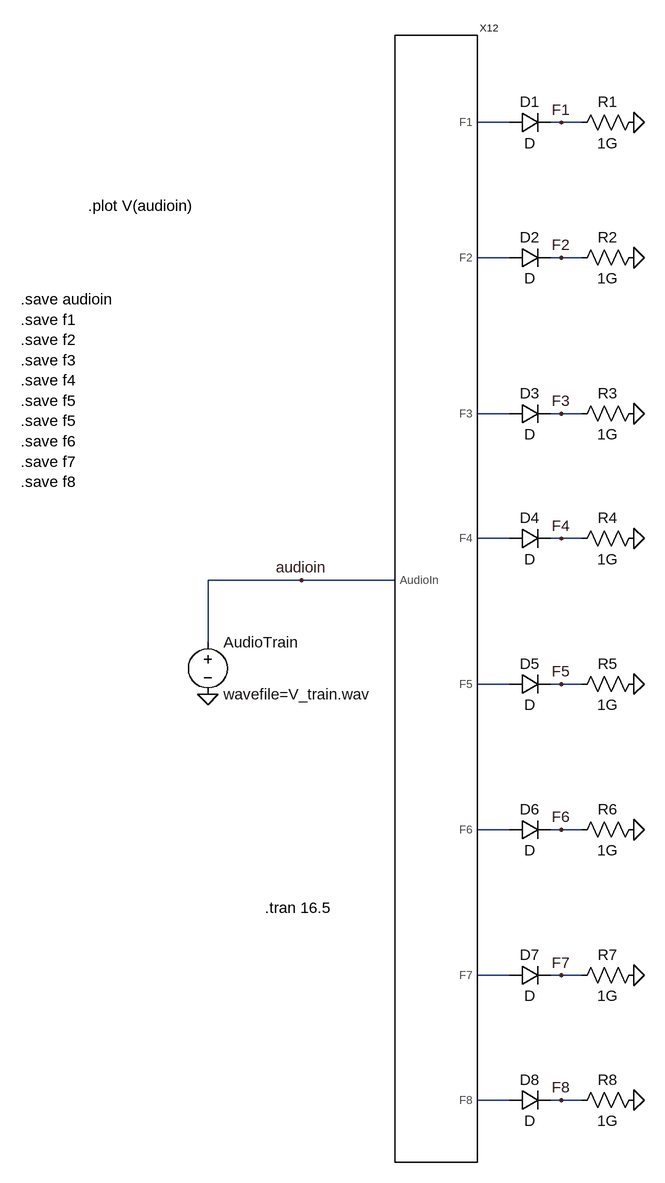
[diagram p0: schematic Filter_Response.asc]
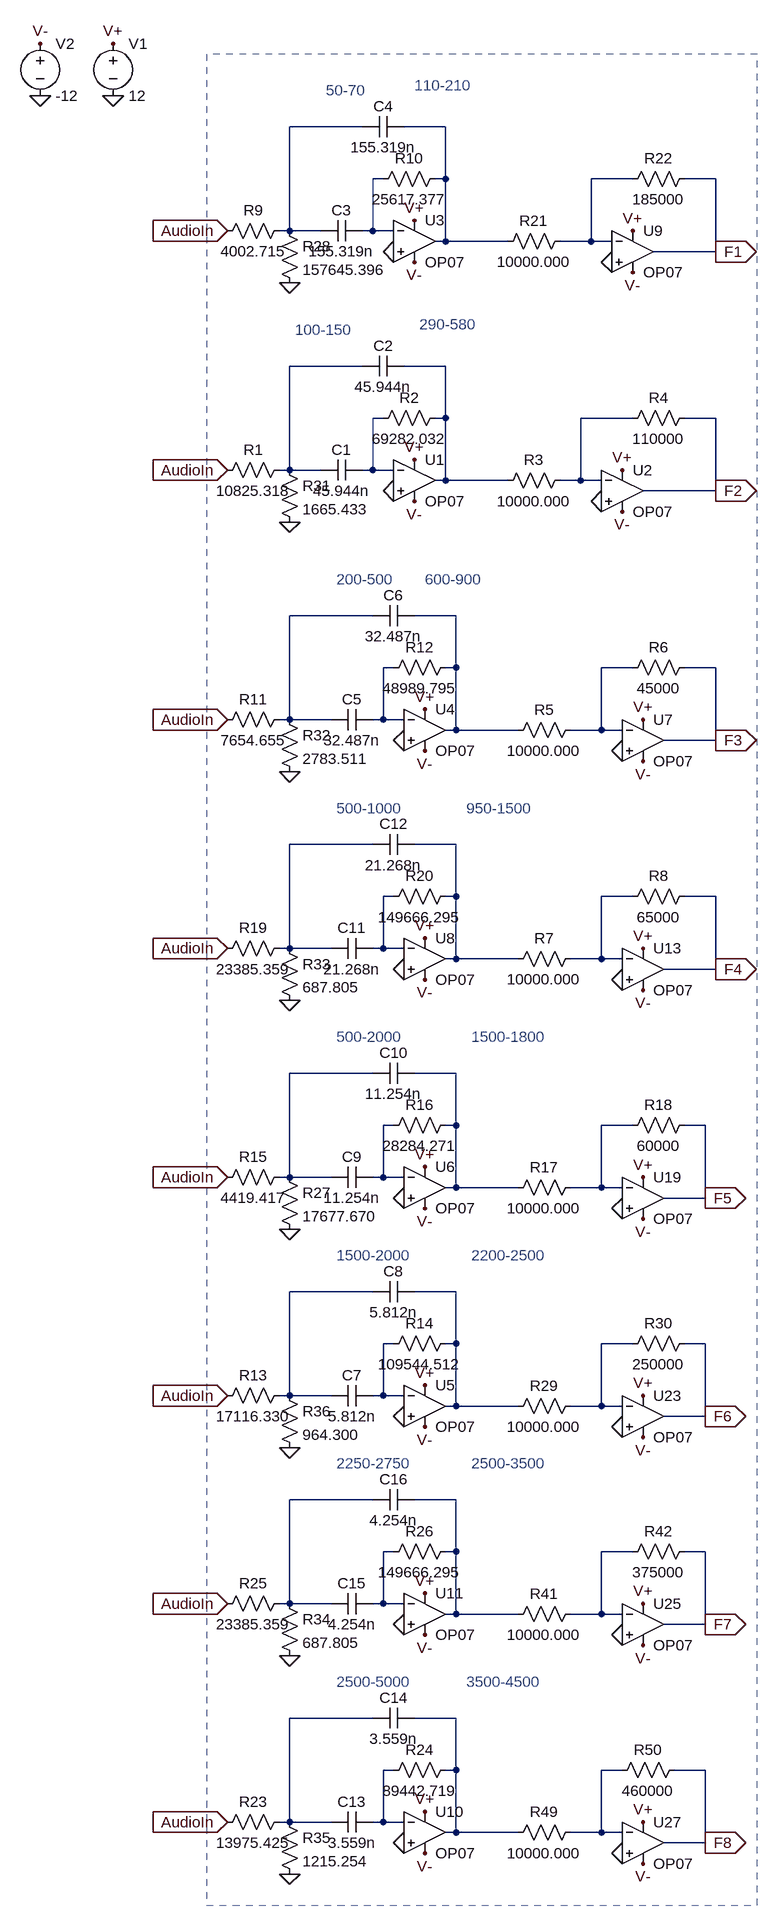
[diagram p1: sub-circuit filterbank.asc]
Filter_Response.asc, the LTspice schematic file:
Version 4
SHEET 1 5076 1812
WIRE 112 -1136 64 -1136
WIRE 192 -1136 176 -1136
WIRE 224 -1136 192 -1136
WIRE 112 -928 64 -928
WIRE 192 -928 176 -928
WIRE 224 -928 192 -928
WIRE 112 -688 64 -688
WIRE 192 -688 176 -688
WIRE 224 -688 192 -688
WIRE 112 -496 64 -496
WIRE 192 -496 176 -496
WIRE 224 -496 192 -496
WIRE -208 -432 -352 -432
WIRE -64 -432 -208 -432
WIRE -352 -336 -352 -432
WIRE 112 -272 64 -272
WIRE 192 -272 176 -272
WIRE 224 -272 192 -272
WIRE 112 -48 64 -48
WIRE 192 -48 176 -48
WIRE 224 -48 192 -48
WIRE 112 176 64 176
WIRE 192 176 176 176
WIRE 224 176 192 176
WIRE 112 368 64 368
WIRE 192 368 176 368
WIRE 224 368 192 368
FLAG -352 -256 0
FLAG -208 -432 audioin
FLAG 304 -1136 0
FLAG 304 -928 0
FLAG 304 -688 0
FLAG 304 -496 0
FLAG 304 -272 0
FLAG 304 -48 0
FLAG 304 176 0
FLAG 304 368 0
FLAG 192 -1136 F1
FLAG 192 -928 F2
FLAG 192 -688 F3
FLAG 192 -496 F4
FLAG 192 -272 F5
FLAG 192 -48 F6
FLAG 192 176 F7
FLAG 192 368 F8
SYMBOL voltage -352 -352 R0
SYMATTR InstName AudioTrain
SYMATTR Value wavefile=V_train.wav
SYMBOL FilterBank -64 464 R0
SYMATTR InstName X12
SYMBOL res 320 -1152 R90
WINDOW 0 0 56 VBottom 2
WINDOW 3 32 56 VTop 2
SYMATTR InstName R1
SYMATTR Value 1G
SYMBOL diode 112 -1120 R270
WINDOW 0 32 32 VTop 2
WINDOW 3 0 32 VBottom 2
SYMATTR InstName D1
SYMBOL res 320 -944 R90
WINDOW 0 0 56 VBottom 2
WINDOW 3 32 56 VTop 2
SYMATTR InstName R2
SYMATTR Value 1G
SYMBOL diode 112 -912 R270
WINDOW 0 32 32 VTop 2
WINDOW 3 0 32 VBottom 2
SYMATTR InstName D2
SYMBOL res 320 -704 R90
WINDOW 0 0 56 VBottom 2
WINDOW 3 32 56 VTop 2
SYMATTR InstName R3
SYMATTR Value 1G
SYMBOL diode 112 -672 R270
WINDOW 0 32 32 VTop 2
WINDOW 3 0 32 VBottom 2
SYMATTR InstName D3
SYMBOL res 320 -512 R90
WINDOW 0 0 56 VBottom 2
WINDOW 3 32 56 VTop 2
SYMATTR InstName R4
SYMATTR Value 1G
SYMBOL diode 112 -480 R270
WINDOW 0 32 32 VTop 2
WINDOW 3 0 32 VBottom 2
SYMATTR InstName D4
SYMBOL res 320 -288 R90
WINDOW 0 0 56 VBottom 2
WINDOW 3 32 56 VTop 2
SYMATTR InstName R5
SYMATTR Value 1G
SYMBOL diode 112 -256 R270
WINDOW 0 32 32 VTop 2
WINDOW 3 0 32 VBottom 2
SYMATTR InstName D5
SYMBOL res 320 -64 R90
WINDOW 0 0 56 VBottom 2
WINDOW 3 32 56 VTop 2
SYMATTR InstName R6
SYMATTR Value 1G
SYMBOL diode 112 -32 R270
WINDOW 0 32 32 VTop 2
WINDOW 3 0 32 VBottom 2
SYMATTR InstName D6
SYMBOL res 320 160 R90
WINDOW 0 0 56 VBottom 2
WINDOW 3 32 56 VTop 2
SYMATTR InstName R7
SYMATTR Value 1G
SYMBOL diode 112 192 R270
WINDOW 0 32 32 VTop 2
WINDOW 3 0 32 VBottom 2
SYMATTR InstName D7
SYMBOL res 320 352 R90
WINDOW 0 0 56 VBottom 2
WINDOW 3 32 56 VTop 2
SYMATTR InstName R8
SYMATTR Value 1G
SYMBOL diode 112 384 R270
WINDOW 0 32 32 VTop 2
WINDOW 3 0 32 VBottom 2
SYMATTR InstName D8
TEXT -264 72 Left 2 !.tran 16.5
TEXT -640 -864 Left 2 !.save audioin\n.save f1\n.save f2\n.save f3\n.save f4\n.save f5\n.save f5\n.save f6\n.save f7\n.save f8
TEXT -536 -1008 Left 2 !.plot V(audioin)

filterbank.asc, the sub-circuit schematic file:
Version 4
SHEET 1 3812 1988
WIRE -704 -2016 -816 -2016
WIRE -576 -2016 -640 -2016
WIRE -672 -1936 -688 -1936
WIRE -576 -1936 -576 -2016
WIRE -576 -1936 -592 -1936
WIRE -288 -1936 -352 -1936
WIRE -160 -1936 -208 -1936
WIRE -816 -1856 -816 -2016
WIRE -816 -1856 -832 -1856
WIRE -768 -1856 -816 -1856
WIRE -688 -1856 -688 -1936
WIRE -688 -1856 -704 -1856
WIRE -656 -1856 -688 -1856
WIRE -576 -1840 -576 -1936
WIRE -576 -1840 -592 -1840
WIRE -480 -1840 -576 -1840
WIRE -352 -1840 -352 -1936
WIRE -352 -1840 -400 -1840
WIRE -320 -1840 -352 -1840
WIRE -160 -1824 -160 -1936
WIRE -160 -1824 -256 -1824
WIRE -704 -1648 -816 -1648
WIRE -576 -1648 -640 -1648
WIRE -672 -1568 -688 -1568
WIRE -576 -1568 -576 -1648
WIRE -576 -1568 -592 -1568
WIRE -288 -1568 -368 -1568
WIRE -160 -1568 -208 -1568
WIRE -816 -1488 -816 -1648
WIRE -816 -1488 -832 -1488
WIRE -768 -1488 -816 -1488
WIRE -688 -1488 -688 -1568
WIRE -688 -1488 -704 -1488
WIRE -656 -1488 -688 -1488
WIRE -576 -1472 -576 -1568
WIRE -576 -1472 -592 -1472
WIRE -480 -1472 -576 -1472
WIRE -368 -1472 -368 -1568
WIRE -368 -1472 -400 -1472
WIRE -336 -1472 -368 -1472
WIRE -160 -1456 -160 -1568
WIRE -160 -1456 -272 -1456
WIRE -688 -1264 -816 -1264
WIRE -560 -1264 -624 -1264
WIRE -656 -1184 -672 -1184
WIRE -560 -1184 -560 -1264
WIRE -560 -1184 -576 -1184
WIRE -288 -1184 -336 -1184
WIRE -160 -1184 -208 -1184
WIRE -816 -1104 -816 -1264
WIRE -816 -1104 -832 -1104
WIRE -752 -1104 -816 -1104
WIRE -672 -1104 -672 -1184
WIRE -672 -1104 -688 -1104
WIRE -640 -1104 -672 -1104
WIRE -560 -1088 -560 -1184
WIRE -560 -1088 -576 -1088
WIRE -464 -1088 -560 -1088
WIRE -336 -1088 -336 -1184
WIRE -336 -1088 -384 -1088
WIRE -304 -1088 -336 -1088
WIRE -160 -1072 -160 -1184
WIRE -160 -1072 -240 -1072
WIRE -688 -912 -816 -912
WIRE -560 -912 -624 -912
WIRE -656 -832 -672 -832
WIRE -560 -832 -560 -912
WIRE -560 -832 -576 -832
WIRE -288 -832 -336 -832
WIRE -160 -832 -208 -832
WIRE -816 -752 -816 -912
WIRE -816 -752 -832 -752
WIRE -752 -752 -816 -752
WIRE -672 -752 -672 -832
WIRE -672 -752 -688 -752
WIRE -640 -752 -672 -752
WIRE -560 -736 -560 -832
WIRE -560 -736 -576 -736
WIRE -464 -736 -560 -736
WIRE -336 -736 -336 -832
WIRE -336 -736 -384 -736
WIRE -304 -736 -336 -736
WIRE -160 -720 -160 -832
WIRE -160 -720 -240 -720
WIRE -688 -560 -816 -560
WIRE -560 -560 -624 -560
WIRE -656 -480 -672 -480
WIRE -560 -480 -560 -560
WIRE -560 -480 -576 -480
WIRE -288 -480 -336 -480
WIRE -176 -480 -208 -480
WIRE -816 -400 -816 -560
WIRE -816 -400 -832 -400
WIRE -752 -400 -816 -400
WIRE -672 -400 -672 -480
WIRE -672 -400 -688 -400
WIRE -640 -400 -672 -400
WIRE -560 -384 -560 -480
WIRE -560 -384 -576 -384
WIRE -464 -384 -560 -384
WIRE -336 -384 -336 -480
WIRE -336 -384 -384 -384
WIRE -304 -384 -336 -384
WIRE -176 -368 -176 -480
WIRE -176 -368 -240 -368
WIRE -688 -224 -816 -224
WIRE -560 -224 -624 -224
WIRE -656 -144 -672 -144
WIRE -560 -144 -560 -224
WIRE -560 -144 -576 -144
WIRE -288 -144 -336 -144
WIRE -176 -144 -208 -144
WIRE -816 -64 -816 -224
WIRE -816 -64 -832 -64
WIRE -752 -64 -816 -64
WIRE -672 -64 -672 -144
WIRE -672 -64 -688 -64
WIRE -640 -64 -672 -64
WIRE -560 -48 -560 -144
WIRE -560 -48 -576 -48
WIRE -464 -48 -560 -48
WIRE -336 -48 -336 -144
WIRE -336 -48 -384 -48
WIRE -304 -48 -336 -48
WIRE -176 -32 -176 -144
WIRE -176 -32 -240 -32
WIRE -688 96 -816 96
WIRE -560 96 -624 96
WIRE -656 176 -672 176
WIRE -560 176 -560 96
WIRE -560 176 -576 176
WIRE -288 176 -336 176
WIRE -176 176 -208 176
WIRE -816 256 -816 96
WIRE -816 256 -832 256
WIRE -752 256 -816 256
WIRE -672 256 -672 176
WIRE -672 256 -688 256
WIRE -640 256 -672 256
WIRE -560 272 -560 176
WIRE -560 272 -576 272
WIRE -464 272 -560 272
WIRE -336 272 -336 176
WIRE -336 272 -384 272
WIRE -304 272 -336 272
WIRE -176 288 -176 176
WIRE -176 288 -240 288
WIRE -688 432 -816 432
WIRE -560 432 -624 432
WIRE -656 512 -672 512
WIRE -560 512 -560 432
WIRE -560 512 -576 512
WIRE -304 512 -336 512
WIRE -176 512 -224 512
WIRE -816 592 -816 432
WIRE -816 592 -832 592
WIRE -752 592 -816 592
WIRE -672 592 -672 512
WIRE -672 592 -688 592
WIRE -640 592 -672 592
WIRE -560 608 -560 512
WIRE -560 608 -576 608
WIRE -464 608 -560 608
WIRE -336 608 -336 512
WIRE -336 608 -384 608
WIRE -304 608 -336 608
WIRE -176 624 -176 512
WIRE -176 624 -240 624
FLAG -288 -1856 V+
FLAG -288 -1792 V-
FLAG -160 -1824 F1
IOPIN -160 -1824 Out
FLAG -176 -368 F5
IOPIN -176 -368 Out
FLAG -176 -32 F6
IOPIN -176 -32 Out
FLAG -160 -1456 F2
IOPIN -160 -1456 Out
FLAG -160 -1072 F3
IOPIN -160 -1072 Out
FLAG -176 624 F8
IOPIN -176 624 Out
FLAG -160 -720 F4
IOPIN -160 -720 Out
FLAG -176 288 F7
IOPIN -176 288 Out
FLAG -320 -1808 0
FLAG -304 -1488 V+
FLAG -304 -1424 V-
FLAG -336 -1440 0
FLAG -272 -1104 V+
FLAG -272 -1040 V-
FLAG -304 -1056 0
FLAG -272 -752 V+
FLAG -272 -688 V-
FLAG -304 -704 0
FLAG -272 -400 V+
FLAG -272 -336 V-
FLAG -304 -352 0
FLAG -272 -64 V+
FLAG -272 0 V-
FLAG -304 -16 0
FLAG -272 256 V+
FLAG -272 320 V-
FLAG -304 304 0
FLAG -272 592 V+
FLAG -272 656 V-
FLAG -304 640 0
FLAG -1200 -2064 0
FLAG -1088 -2064 0
FLAG -1088 -2144 V+
FLAG -1200 -2144 V-
FLAG -624 -1504 V+
FLAG -624 -1440 V-
FLAG -656 -1456 0
FLAG -624 -1872 V+
FLAG -624 -1808 V-
FLAG -656 -1824 0
FLAG -608 -1120 V+
FLAG -608 -1056 V-
FLAG -640 -1072 0
FLAG -608 -80 V+
FLAG -608 -16 V-
FLAG -640 -32 0
FLAG -608 -416 V+
FLAG -608 -352 V-
FLAG -640 -368 0
FLAG -608 -768 V+
FLAG -608 -704 V-
FLAG -640 -720 0
FLAG -608 576 V+
FLAG -608 640 V-
FLAG -640 624 0
FLAG -608 240 V+
FLAG -608 304 V-
FLAG -640 288 0
FLAG -912 -1856 AudioIn
IOPIN -912 -1856 In
FLAG -912 -752 AudioIn
IOPIN -912 -752 In
FLAG -912 -1488 AudioIn
IOPIN -912 -1488 In
FLAG -912 -400 AudioIn
IOPIN -912 -400 In
FLAG -912 -1104 AudioIn
IOPIN -912 -1104 In
FLAG -912 256 AudioIn
IOPIN -912 256 In
FLAG -912 -64 AudioIn
IOPIN -912 -64 In
FLAG -912 592 AudioIn
IOPIN -912 592 In
FLAG -816 -320 0
FLAG -816 -1776 0
FLAG -816 672 0
FLAG -816 -1408 0
FLAG -816 -1024 0
FLAG -816 -672 0
FLAG -816 16 0
FLAG -816 336 0
SYMBOL Opamps\\OP07 -288 -1888 R0
SYMATTR InstName U9
SYMBOL res -384 -1856 R90
WINDOW 0 0 56 VBottom 2
WINDOW 3 32 56 VTop 2
SYMATTR InstName R21
SYMATTR Value 10000.000
SYMBOL res -192 -1952 R90
WINDOW 0 0 56 VBottom 2
WINDOW 3 32 56 VTop 2
SYMATTR InstName R22
SYMATTR Value 185000
SYMBOL Opamps\\OP07 -304 -1520 R0
SYMATTR InstName U2
SYMBOL res -384 -1488 R90
WINDOW 0 0 56 VBottom 2
WINDOW 3 32 56 VTop 2
SYMATTR InstName R3
SYMATTR Value 10000.000
SYMBOL res -192 -1584 R90
WINDOW 0 0 56 VBottom 2
WINDOW 3 32 56 VTop 2
SYMATTR InstName R4
SYMATTR Value 110000
SYMBOL Opamps\\OP07 -272 -1136 R0
SYMATTR InstName U7
SYMBOL res -368 -1104 R90
WINDOW 0 0 56 VBottom 2
WINDOW 3 32 56 VTop 2
SYMATTR InstName R5
SYMATTR Value 10000.000
SYMBOL res -192 -1200 R90
WINDOW 0 0 56 VBottom 2
WINDOW 3 32 56 VTop 2
SYMATTR InstName R6
SYMATTR Value 45000
SYMBOL Opamps\\OP07 -272 -784 R0
SYMATTR InstName U13
SYMBOL res -368 -752 R90
WINDOW 0 0 56 VBottom 2
WINDOW 3 32 56 VTop 2
SYMATTR InstName R7
SYMATTR Value 10000.000
SYMBOL res -192 -848 R90
WINDOW 0 0 56 VBottom 2
WINDOW 3 32 56 VTop 2
SYMATTR InstName R8
SYMATTR Value 65000
SYMBOL Opamps\\OP07 -272 -432 R0
SYMATTR InstName U19
SYMBOL res -368 -400 R90
WINDOW 0 0 56 VBottom 2
WINDOW 3 32 56 VTop 2
SYMATTR InstName R17
SYMATTR Value 10000.000
SYMBOL res -192 -496 R90
WINDOW 0 0 56 VBottom 2
WINDOW 3 32 56 VTop 2
SYMATTR InstName R18
SYMATTR Value 60000
SYMBOL Opamps\\OP07 -272 -96 R0
SYMATTR InstName U23
SYMBOL res -368 -64 R90
WINDOW 0 0 56 VBottom 2
WINDOW 3 32 56 VTop 2
SYMATTR InstName R29
SYMATTR Value 10000.000
SYMBOL res -192 -160 R90
WINDOW 0 0 56 VBottom 2
WINDOW 3 32 56 VTop 2
SYMATTR InstName R30
SYMATTR Value 250000
SYMBOL Opamps\\OP07 -272 224 R0
SYMATTR InstName U25
SYMBOL res -368 256 R90
WINDOW 0 0 56 VBottom 2
WINDOW 3 32 56 VTop 2
SYMATTR InstName R41
SYMATTR Value 10000.000
SYMBOL res -192 160 R90
WINDOW 0 0 56 VBottom 2
WINDOW 3 32 56 VTop 2
SYMATTR InstName R42
SYMATTR Value 375000
SYMBOL Opamps\\OP07 -272 560 R0
SYMATTR InstName U27
SYMBOL res -368 592 R90
WINDOW 0 0 56 VBottom 2
WINDOW 3 32 56 VTop 2
SYMATTR InstName R49
SYMATTR Value 10000.000
SYMBOL res -208 496 R90
WINDOW 0 0 56 VBottom 2
WINDOW 3 32 56 VTop 2
SYMATTR InstName R50
SYMATTR Value 460000
SYMBOL voltage -1088 -2160 R0
WINDOW 123 0 0 Left 2
WINDOW 39 0 0 Left 2
SYMATTR InstName V1
SYMATTR Value 12
SYMBOL voltage -1200 -2160 R0
WINDOW 123 0 0 Left 2
WINDOW 39 0 0 Left 2
SYMATTR InstName V2
SYMATTR Value -12
SYMBOL Opamps\\OP07 -624 -1536 R0
SYMATTR InstName U1
SYMBOL res -816 -1504 R90
WINDOW 0 0 56 VBottom 2
WINDOW 3 32 56 VTop 2
SYMATTR InstName R1
SYMATTR Value 10825.318
SYMBOL cap -704 -1504 R90
WINDOW 0 0 32 VBottom 2
WINDOW 3 32 32 VTop 2
SYMATTR InstName C1
SYMATTR Value 45.944n
SYMBOL cap -640 -1664 R90
WINDOW 0 0 32 VBottom 2
WINDOW 3 32 32 VTop 2
SYMATTR InstName C2
SYMATTR Value 45.944n
SYMBOL res -576 -1584 R90
WINDOW 0 0 56 VBottom 2
WINDOW 3 32 56 VTop 2
SYMATTR InstName R2
SYMATTR Value 69282.032
SYMBOL Opamps\\OP07 -624 -1904 R0
SYMATTR InstName U3
SYMBOL res -816 -1872 R90
WINDOW 0 0 56 VBottom 2
WINDOW 3 32 56 VTop 2
SYMATTR InstName R9
SYMATTR Value 4002.715
SYMBOL cap -704 -1872 R90
WINDOW 0 0 32 VBottom 2
WINDOW 3 32 32 VTop 2
SYMATTR InstName C3
SYMATTR Value 155.319n
SYMBOL cap -640 -2032 R90
WINDOW 0 0 32 VBottom 2
WINDOW 3 32 32 VTop 2
SYMATTR InstName C4
SYMATTR Value 155.319n
SYMBOL res -576 -1952 R90
WINDOW 0 0 56 VBottom 2
WINDOW 3 32 56 VTop 2
SYMATTR InstName R10
SYMATTR Value 25617.377
SYMBOL Opamps\\OP07 -608 -1152 R0
SYMATTR InstName U4
SYMBOL res -816 -1120 R90
WINDOW 0 0 56 VBottom 2
WINDOW 3 32 56 VTop 2
SYMATTR InstName R11
SYMATTR Value 7654.655
SYMBOL cap -688 -1120 R90
WINDOW 0 0 32 VBottom 2
WINDOW 3 32 32 VTop 2
SYMATTR InstName C5
SYMATTR Value 32.487n
SYMBOL cap -624 -1280 R90
WINDOW 0 0 32 VBottom 2
WINDOW 3 32 32 VTop 2
SYMATTR InstName C6
SYMATTR Value 32.487n
SYMBOL res -560 -1200 R90
WINDOW 0 0 56 VBottom 2
WINDOW 3 32 56 VTop 2
SYMATTR InstName R12
SYMATTR Value 48989.795
SYMBOL Opamps\\OP07 -608 -112 R0
SYMATTR InstName U5
SYMBOL res -816 -80 R90
WINDOW 0 0 56 VBottom 2
WINDOW 3 32 56 VTop 2
SYMATTR InstName R13
SYMATTR Value 17116.330
SYMBOL cap -688 -80 R90
WINDOW 0 0 32 VBottom 2
WINDOW 3 32 32 VTop 2
SYMATTR InstName C7
SYMATTR Value 5.812n
SYMBOL cap -624 -240 R90
WINDOW 0 0 32 VBottom 2
WINDOW 3 32 32 VTop 2
SYMATTR InstName C8
SYMATTR Value 5.812n
SYMBOL res -560 -160 R90
WINDOW 0 0 56 VBottom 2
WINDOW 3 32 56 VTop 2
SYMATTR InstName R14
SYMATTR Value 109544.512
SYMBOL Opamps\\OP07 -608 -448 R0
SYMATTR InstName U6
SYMBOL res -816 -416 R90
WINDOW 0 0 56 VBottom 2
WINDOW 3 32 56 VTop 2
SYMATTR InstName R15
SYMATTR Value 4419.417
SYMBOL cap -688 -416 R90
WINDOW 0 0 32 VBottom 2
WINDOW 3 32 32 VTop 2
SYMATTR InstName C9
SYMATTR Value 11.254n
SYMBOL cap -624 -576 R90
WINDOW 0 0 32 VBottom 2
WINDOW 3 32 32 VTop 2
SYMATTR InstName C10
SYMATTR Value 11.254n
SYMBOL res -560 -496 R90
WINDOW 0 0 56 VBottom 2
WINDOW 3 32 56 VTop 2
SYMATTR InstName R16
SYMATTR Value 28284.271
SYMBOL Opamps\\OP07 -608 -800 R0
SYMATTR InstName U8
SYMBOL res -816 -768 R90
WINDOW 0 0 56 VBottom 2
WINDOW 3 32 56 VTop 2
SYMATTR InstName R19
SYMATTR Value 23385.359
SYMBOL cap -688 -768 R90
WINDOW 0 0 32 VBottom 2
WINDOW 3 32 32 VTop 2
SYMATTR InstName C11
SYMATTR Value 21.268n
SYMBOL cap -624 -928 R90
WINDOW 0 0 32 VBottom 2
WINDOW 3 32 32 VTop 2
SYMATTR InstName C12
SYMATTR Value 21.268n
SYMBOL res -560 -848 R90
WINDOW 0 0 56 VBottom 2
WINDOW 3 32 56 VTop 2
SYMATTR InstName R20
SYMATTR Value 149666.295
SYMBOL Opamps\\OP07 -608 544 R0
SYMATTR InstName U10
SYMBOL res -816 576 R90
WINDOW 0 0 56 VBottom 2
WINDOW 3 32 56 VTop 2
SYMATTR InstName R23
SYMATTR Value 13975.425
SYMBOL cap -688 576 R90
WINDOW 0 0 32 VBottom 2
WINDOW 3 32 32 VTop 2
SYMATTR InstName C13
SYMATTR Value 3.559n
SYMBOL cap -624 416 R90
WINDOW 0 0 32 VBottom 2
WINDOW 3 32 32 VTop 2
SYMATTR InstName C14
SYMATTR Value 3.559n
SYMBOL res -560 496 R90
WINDOW 0 0 56 VBottom 2
WINDOW 3 32 56 VTop 2
SYMATTR InstName R24
SYMATTR Value 89442.719
SYMBOL Opamps\\OP07 -608 208 R0
SYMATTR InstName U11
SYMBOL res -816 240 R90
WINDOW 0 0 56 VBottom 2
WINDOW 3 32 56 VTop 2
SYMATTR InstName R25
SYMATTR Value 23385.359
SYMBOL cap -688 240 R90
WINDOW 0 0 32 VBottom 2
WINDOW 3 32 32 VTop 2
SYMATTR InstName C15
SYMATTR Value 4.254n
SYMBOL cap -624 80 R90
WINDOW 0 0 32 VBottom 2
WINDOW 3 32 32 VTop 2
SYMATTR InstName C16
SYMATTR Value 4.254n
SYMBOL res -560 160 R90
WINDOW 0 0 56 VBottom 2
WINDOW 3 32 56 VTop 2
SYMATTR InstName R26
SYMATTR Value 149666.295
SYMBOL res -832 -416 R0
SYMATTR InstName R27
SYMATTR Value 17677.670
SYMBOL res -832 -1872 R0
SYMATTR InstName R28
SYMATTR Value 157645.396
SYMBOL res -832 -1504 R0
SYMATTR InstName R31
SYMATTR Value 1665.433
SYMBOL res -832 -1120 R0
SYMATTR InstName R32
SYMATTR Value 2783.511
SYMBOL res -832 -768 R0
SYMATTR InstName R33
SYMATTR Value 687.805
SYMBOL res -832 240 R0
SYMATTR InstName R34
SYMATTR Value 687.805
SYMBOL res -832 576 R0
SYMATTR InstName R35
SYMATTR Value 1215.254
SYMBOL res -832 -80 R0
SYMATTR InstName R36
SYMATTR Value 964.300
TEXT -544 -968 Left 2 ;950-1500
TEXT -536 -616 Left 2 ;1500-1800
TEXT -536 -280 Left 2 ;2200-2500
TEXT -536 40 Left 2 ;2500-3500
TEXT -544 376 Left 2 ;3500-4500
TEXT -808 -1704 Left 2 ;100-150
TEXT -760 -2072 Left 2 ;50-70
TEXT -744 -1320 Left 2 ;200-500
TEXT -744 -280 Left 2 ;1500-2000
TEXT -744 -616 Left 2 ;500-2000
TEXT -744 -968 Left 2 ;500-1000
TEXT -744 376 Left 2 ;2500-5000
TEXT -744 40 Left 2 ;2250-2750
TEXT -624 -2080 Left 2 ;110-210
TEXT -616 -1712 Left 2 ;290-580
TEXT -608 -1320 Left 2 ;600-900
RECTANGLE Normal -96 -2128 -944 720 1

The netlist it stands for:
* Filter_Response.asc
V§AudioTrain audioin 0 wavefile=V_train.wav
XX12 N001 N002 N003 N004 N005 N006 N007 N008 audioin filterbank
R1 0 F1 1G
D1 N001 F1 D
R2 0 F2 1G
D2 N002 F2 D
R3 0 F3 1G
D3 N003 F3 D
R4 0 F4 1G
D4 N004 F4 D
R5 0 F5 1G
D5 N005 F5 D
R6 0 F6 1G
D6 N006 F6 D
R7 0 F7 1G
D7 N007 F7 D
R8 0 F8 1G
D8 N008 F8 D

* block symbol definitions
.subckt filterbank F1 F2 F3 F4 F5 F6 F7 F8 AudioIn
XU9 0 N004 V+ V- F1 LT1001  ; OP07, pins In+ In- V+ V- OUT
R21 N004 N002 10000.000
R22 F1 N004 185000
XU2 0 N008 V+ V- F2 LT1001  ; OP07, pins In+ In- V+ V- OUT
R3 N008 N006 10000.000
R4 F2 N008 110000
XU7 0 N012 V+ V- F3 LT1001  ; OP07, pins In+ In- V+ V- OUT
R5 N012 N010 10000.000
R6 F3 N012 45000
XU13 0 N016 V+ V- F4 LT1001  ; OP07, pins In+ In- V+ V- OUT
R7 N016 N014 10000.000
R8 F4 N016 65000
XU19 0 N020 V+ V- F5 LT1001  ; OP07, pins In+ In- V+ V- OUT
R17 N020 N018 10000.000
R18 F5 N020 60000
XU23 0 N024 V+ V- F6 LT1001  ; OP07, pins In+ In- V+ V- OUT
R29 N024 N022 10000.000
R30 F6 N024 250000
XU25 0 N028 V+ V- F7 LT1001  ; OP07, pins In+ In- V+ V- OUT
R41 N028 N026 10000.000
R42 F7 N028 375000
XU27 0 N032 V+ V- F8 LT1001  ; OP07, pins In+ In- V+ V- OUT
R49 N032 N030 10000.000
R50 F8 N032 460000
V1 V+ 0 12
V2 V- 0 -12
XU1 0 N007 V+ V- N006 LT1001  ; OP07, pins In+ In- V+ V- OUT
R1 N005 AudioIn 10825.318
C1 N007 N005 45.944n
C2 N006 N005 45.944n
R2 N006 N007 69282.032
XU3 0 N003 V+ V- N002 LT1001  ; OP07, pins In+ In- V+ V- OUT
R9 N001 AudioIn 4002.715
C3 N003 N001 155.319n
C4 N002 N001 155.319n
R10 N002 N003 25617.377
XU4 0 N011 V+ V- N010 LT1001  ; OP07, pins In+ In- V+ V- OUT
R11 N009 AudioIn 7654.655
C5 N011 N009 32.487n
C6 N010 N009 32.487n
R12 N010 N011 48989.795
XU5 0 N023 V+ V- N022 LT1001  ; OP07, pins In+ In- V+ V- OUT
R13 N021 AudioIn 17116.330
C7 N023 N021 5.812n
C8 N022 N021 5.812n
R14 N022 N023 109544.512
XU6 0 N019 V+ V- N018 LT1001  ; OP07, pins In+ In- V+ V- OUT
R15 N017 AudioIn 4419.417
C9 N019 N017 11.254n
C10 N018 N017 11.254n
R16 N018 N019 28284.271
XU8 0 N015 V+ V- N014 LT1001  ; OP07, pins In+ In- V+ V- OUT
R19 N013 AudioIn 23385.359
C11 N015 N013 21.268n
C12 N014 N013 21.268n
R20 N014 N015 149666.295
XU10 0 N031 V+ V- N030 LT1001  ; OP07, pins In+ In- V+ V- OUT
R23 N029 AudioIn 13975.425
C13 N031 N029 3.559n
C14 N030 N029 3.559n
R24 N030 N031 89442.719
XU11 0 N027 V+ V- N026 LT1001  ; OP07, pins In+ In- V+ V- OUT
R25 N025 AudioIn 23385.359
C15 N027 N025 4.254n
C16 N026 N025 4.254n
R26 N026 N027 149666.295
R27 N017 0 17677.670
R28 N001 0 157645.396
R31 N005 0 1665.433
R32 N009 0 2783.511
R33 N013 0 687.805
R34 N025 0 687.805
R35 N029 0 1215.254
R36 N021 0 964.300
* 950-1500
* 1500-1800
* 2200-2500
* 2500-3500
* 3500-4500
* 100-150
* 50-70
* 200-500
* 1500-2000
* 500-2000
* 500-1000
* 2500-5000
* 2250-2750
* 110-210
* 290-580
* 600-900
.ends filterbank

.model D D
.lib standard.dio
.tran 16.5
.save audioin
.save f1
.save f2
.save f3
.save f4
.save f5
.save f5
.save f6
.save f7
.save f8
.plot V(audioin)
.lib LTC.lib
.backanno
.end